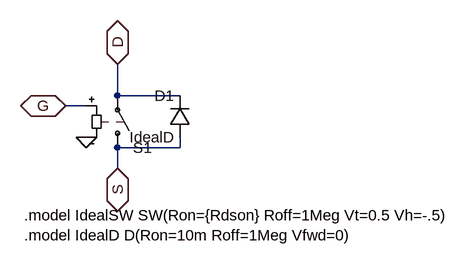
[diagram p0: schematic IdealSW.asc]
IdealSW.asc, the LTspice schematic file:
Version 4
SHEET 1 880 680
WIRE 336 144 336 96
WIRE 432 144 336 144
WIRE 288 160 256 160
WIRE 432 224 432 208
WIRE 432 224 336 224
WIRE 336 256 336 224
FLAG 288 208 0
FLAG 256 160 G
IOPIN 256 160 BiDir
FLAG 336 96 D
IOPIN 336 96 BiDir
FLAG 336 256 S
IOPIN 336 256 BiDir
SYMBOL sw 336 240 M180
WINDOW 3 24 96 Invisible 2
SYMATTR Value IdealSW
SYMATTR InstName S1
SYMBOL diode 448 208 R180
WINDOW 0 24 64 Left 2
WINDOW 3 24 0 Left 2
SYMATTR InstName D1
SYMATTR Value IdealD
TEXT 192 328 Left 2 !.model IdealSW SW(Ron={Rdson} Roff=1Meg Vt=0.5 Vh=-.5)\n.model IdealD D(Ron=10m Roff=1Meg Vfwd=0)

The netlist it stands for:
* IdealSW.asc
S1 S D G 0 IdealSW
D1 S D IdealD
.model D D
.lib standard.dio
.model IdealSW SW(Ron={Rdson} Roff=1Meg Vt=0.5 Vh=-.5)
.model IdealD D(Ron=10m Roff=1Meg Vfwd=0)
.backanno
.end